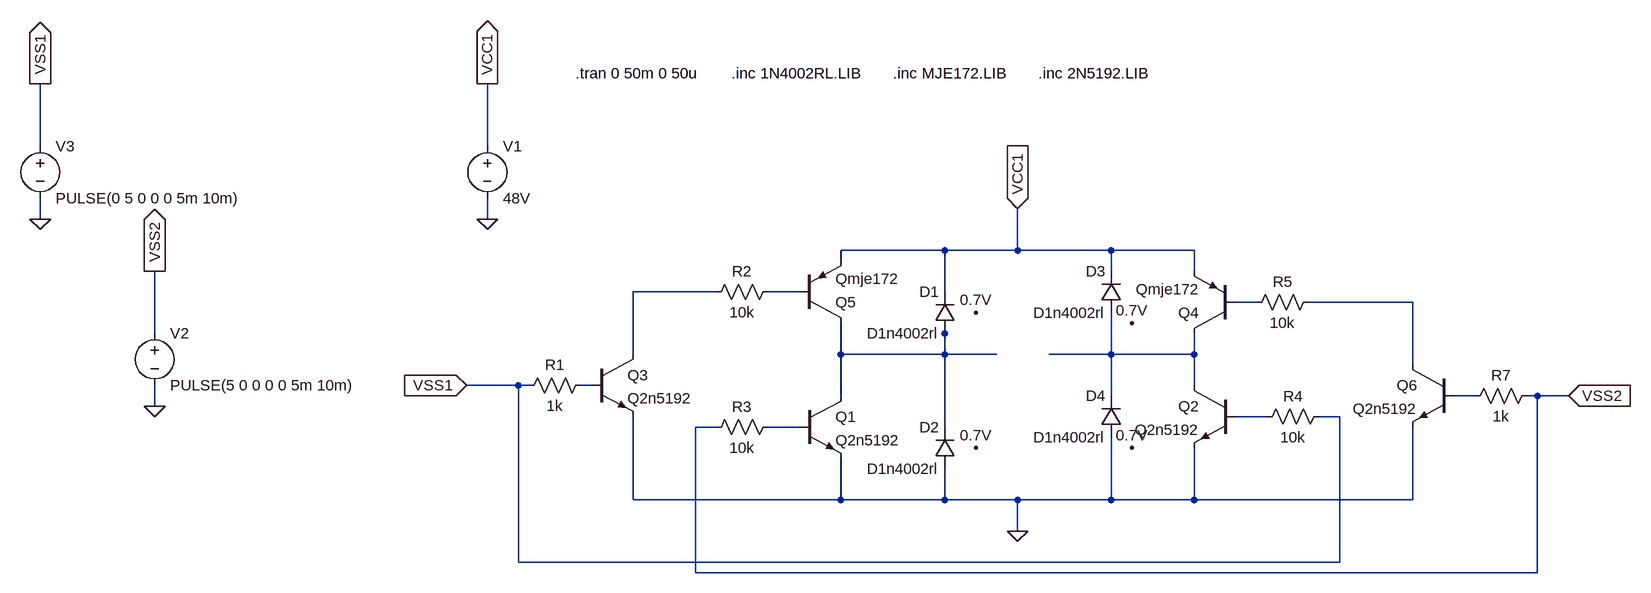
[diagram p0: schematic H-Bridge_w_Protection_diodes.asc]
H-Bridge_w_Protection_diodes.asc, the LTspice schematic file:
Version 4
SHEET 1 1096 680
WIRE -1584 -656 -1584 -752
WIRE -896 -656 -896 -752
WIRE -1584 -544 -1584 -576
WIRE -896 -544 -896 -576
WIRE -192 -496 -352 -496
WIRE -80 -496 -80 -560
WIRE -80 -496 -192 -496
WIRE 64 -496 -80 -496
WIRE 192 -496 64 -496
WIRE -352 -480 -352 -496
WIRE 64 -464 64 -496
WIRE 192 -464 192 -496
WIRE -544 -432 -672 -432
WIRE -416 -432 -464 -432
WIRE -192 -432 -192 -496
WIRE 288 -416 256 -416
WIRE 528 -416 368 -416
WIRE -1408 -368 -1408 -464
WIRE -192 -368 -192 -384
WIRE -672 -336 -672 -432
WIRE -352 -336 -352 -384
WIRE -192 -336 -192 -368
WIRE -192 -336 -352 -336
WIRE -112 -336 -192 -336
WIRE 64 -336 64 -400
WIRE 64 -336 -32 -336
WIRE 192 -336 192 -368
WIRE 192 -336 64 -336
WIRE 528 -320 528 -416
WIRE -848 -288 -928 -288
WIRE -832 -288 -848 -288
WIRE -736 -288 -752 -288
WIRE 192 -288 192 -336
WIRE -352 -272 -352 -336
WIRE 64 -272 64 -336
WIRE 624 -272 592 -272
WIRE 720 -272 704 -272
WIRE 768 -272 720 -272
WIRE -1408 -256 -1408 -288
WIRE 304 -240 256 -240
WIRE 416 -240 384 -240
WIRE -544 -224 -576 -224
WIRE -416 -224 -464 -224
WIRE -192 -224 -192 -336
WIRE -672 -112 -672 -240
WIRE -352 -112 -352 -176
WIRE -352 -112 -672 -112
WIRE -192 -112 -192 -160
WIRE -192 -112 -352 -112
WIRE -80 -112 -192 -112
WIRE 64 -112 64 -208
WIRE 64 -112 -80 -112
WIRE 192 -112 192 -192
WIRE 192 -112 64 -112
WIRE 528 -112 528 -224
WIRE 528 -112 192 -112
WIRE -80 -64 -80 -112
WIRE -848 -16 -848 -288
WIRE 416 -16 416 -240
WIRE 416 -16 -848 -16
WIRE -576 0 -576 -224
WIRE 720 0 720 -272
WIRE 720 0 -576 0
FLAG -80 -560 VCC1
IOPIN -80 -560 In
FLAG -896 -544 0
FLAG -896 -752 VCC1
IOPIN -896 -752 Out
FLAG -80 -64 0
FLAG -1408 -256 0
FLAG -1408 -464 VSS2
IOPIN -1408 -464 Out
FLAG -928 -288 VSS1
IOPIN -928 -288 In
FLAG 768 -272 VSS2
IOPIN 768 -272 In
FLAG -1584 -544 0
FLAG -1584 -752 VSS1
IOPIN -1584 -752 Out
FLAG -144 -400 0.7V
FLAG -144 -192 0.7V
FLAG 96 -192 0.7V
FLAG 96 -384 0.7V
SYMBOL voltage -896 -672 R0
SYMATTR InstName V1
SYMATTR Value 48V
SYMBOL diode -176 -368 R180
WINDOW 0 24 64 Left 2
WINDOW 3 24 0 Left 2
SYMATTR InstName D1
SYMATTR Value D1n4002rl
SYMBOL diode -176 -160 R180
WINDOW 0 24 64 Left 2
WINDOW 3 24 0 Left 2
SYMATTR InstName D2
SYMATTR Value D1n4002rl
SYMBOL diode 80 -400 R180
WINDOW 0 24 64 Left 2
WINDOW 3 24 0 Left 2
SYMATTR InstName D3
SYMATTR Value D1n4002rl
SYMBOL diode 80 -208 R180
WINDOW 0 24 64 Left 2
WINDOW 3 24 0 Left 2
SYMATTR InstName D4
SYMATTR Value D1n4002rl
SYMBOL res -448 -448 R90
WINDOW 0 0 56 VBottom 2
WINDOW 3 32 56 VTop 2
SYMATTR InstName R2
SYMATTR Value 10k
SYMBOL res 400 -256 R90
WINDOW 0 0 56 VBottom 2
WINDOW 3 32 56 VTop 2
SYMATTR InstName R4
SYMATTR Value 10k
SYMBOL res 384 -432 R90
WINDOW 0 0 56 VBottom 2
WINDOW 3 32 56 VTop 2
SYMATTR InstName R5
SYMATTR Value 10k
SYMBOL voltage -1408 -384 R0
WINDOW 123 0 0 Left 0
WINDOW 39 0 0 Left 0
SYMATTR InstName V2
SYMATTR Value PULSE(5 0 0 0 0 5m 10m)
SYMBOL res -448 -240 R90
WINDOW 0 0 56 VBottom 2
WINDOW 3 32 56 VTop 2
SYMATTR InstName R3
SYMATTR Value 10k
SYMBOL voltage -1584 -672 R0
WINDOW 123 0 0 Left 0
WINDOW 39 0 0 Left 0
SYMATTR InstName V3
SYMATTR Value PULSE(0 5 0 0 0 5m 10m)
SYMBOL npn -416 -272 R0
SYMATTR InstName Q1
SYMATTR Value Q2n5192
SYMBOL pnp 256 -368 R180
SYMATTR InstName Q4
SYMATTR Value Qmje172
SYMBOL pnp -416 -384 M180
SYMATTR InstName Q5
SYMATTR Value Qmje172
SYMBOL npn 256 -288 M0
SYMATTR InstName Q2
SYMATTR Value Q2n5192
SYMBOL npn -736 -336 R0
SYMATTR InstName Q3
SYMATTR Value Q2n5192
SYMBOL res -736 -304 R90
WINDOW 0 0 56 VBottom 2
WINDOW 3 32 56 VTop 2
SYMATTR InstName R1
SYMATTR Value 1k
SYMBOL res 720 -288 R90
WINDOW 0 0 56 VBottom 2
WINDOW 3 32 56 VTop 2
SYMATTR InstName R7
SYMATTR Value 1k
SYMBOL npn 592 -320 M0
SYMATTR InstName Q6
SYMATTR Value Q2n5192
TEXT -520 -768 Left 2 !.inc 1N4002RL.LIB
TEXT -760 -768 Left 2 !.tran 0 50m 0 50u
TEXT -272 -768 Left 2 !.inc MJE172.LIB
TEXT -48 -768 Left 2 !.inc 2N5192.LIB

The netlist it stands for:
* H-Bridge_w_Protection_diodes.asc
V1 VCC1 0 48V
D1 N005 VCC1 D1n4002rl
D2 0 N005 D1n4002rl
D3 N006 VCC1 D1n4002rl
D4 0 N006 D1n4002rl
R2 N002 N001 10k
R4 VSS1 N009 10k
R5 N004 N003 10k
V2 VSS2 0 PULSE(5 0 0 0 0 5m 10m)
R3 N010 VSS2 10k
V3 VSS1 0 PULSE(0 5 0 0 0 5m 10m)
Q1 N005 N010 0 0 Q2n5192
Q4 N006 N003 VCC1 0 Qmje172
Q5 N005 N002 VCC1 0 Qmje172
Q2 N006 N009 0 0 Q2n5192
Q3 N001 N007 0 0 Q2n5192
R1 N007 VSS1 1k
R7 VSS2 N008 1k
Q6 N004 N008 0 0 Q2n5192
.model D D
.lib standard.dio
.model NPN NPN
.model PNP PNP
.lib standard.bjt
.inc 1N4002RL.LIB
.tran 0 50m 0 50u
.inc MJE172.LIB
.inc 2N5192.LIB
.backanno
.end